# Altium schematic sheet audio_in.SchDoc
size A4
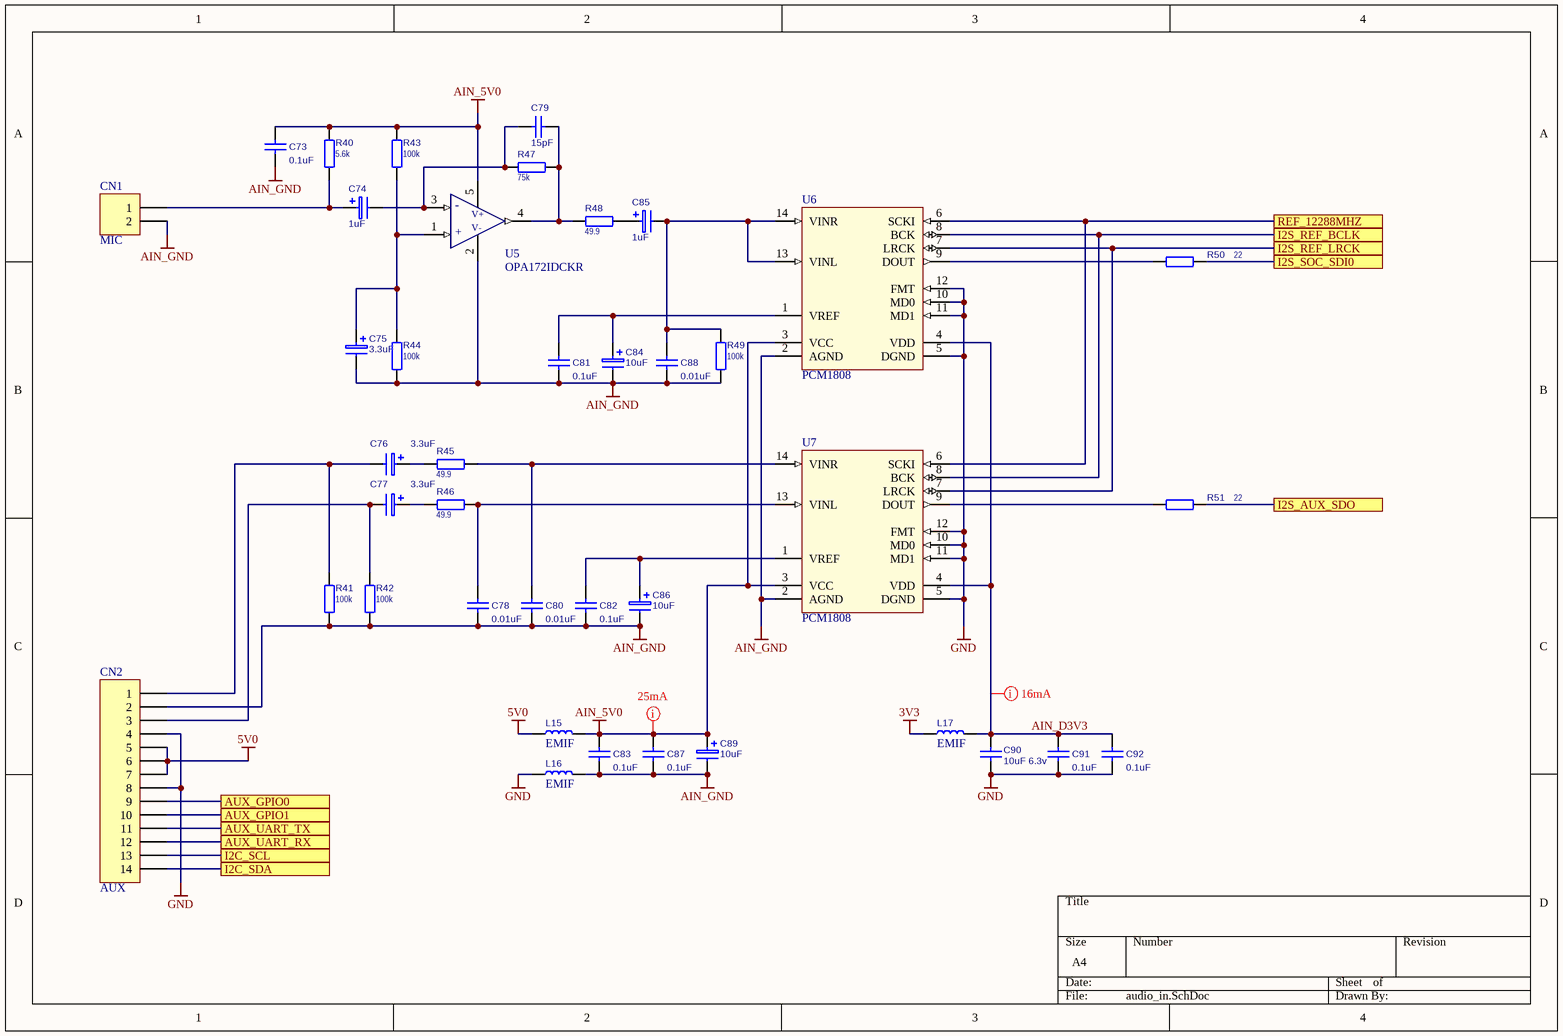
[diagram p0: audio_in.SchDoc]

## Parts
C73  value 0.1uF  [C0603]  (hidden comment: CC0603KRX7R9BB104)
C74  1uF  [ALUM_4]
C75  3.3uF  [ALUM_3.3]
C76  value 3.3uF  [ALUM_3.3]  (hidden comment: UWT1V3R3MCL2B)
C77  value 3.3uF  [ALUM_3.3]  (hidden comment: UWT1V3R3MCL2B)
C78  value 0.01uF  [C0603]  (hidden comment: CL10B103KB8NNNC)
C79  value 15pF  [C0603]  (hidden comment: CC0603GRNPO9BN150)
C80  value 0.01uF  [C0603]  (hidden comment: CL10B103KB8NNNC)
C81  value 0.1uF  [C0603]  (hidden comment: CC0603KRX7R9BB104)
C82  value 0.1uF  [C0603]  (hidden comment: CC0603KRX7R9BB104)
C83  value 0.1uF  [C0603]  (hidden comment: CC0603KRX7R9BB104)
C84  value 10uF  [ALUM_4]  (hidden comment: CB016M0010RSB-0405)
C85  1uF  [ALUM_4]
C86  value 10uF  [ALUM_4]  (hidden comment: CB016M0010RSB-0405)
C87  value 0.1uF  [C0603]  (hidden comment: CC0603KRX7R9BB104)
C88  value 0.01uF  [C0603]  (hidden comment: CL10B103KB8NNNC)
C89  value 10uF  [ALUM_3.3]  (hidden comment: CB016M0010RSB-0405)
C90  value 10uF 6.3v  [C0603]  (hidden comment: CC0603MRX5R5BB106)
C91  value 0.1uF  [C0603]  (hidden comment: CC0603KRX7R9BB104)
C92  value 0.1uF  [C0603]  (hidden comment: CC0603KRX7R9BB104)
CN1  MIC  [DG308-2.54-2P]
CN2  AUX  [PLS-14R]
L15  value EMIF  [IND0603]  (hidden comment: BLM18AG102SN1D)
L16  value EMIF  [IND0603]  (hidden comment: BLM18AG102SN1D)
L17  value EMIF  [IND0603]  (hidden comment: BLM18AG102SN1D)
R40  5.6k  [R0603]
R41  100k  [R0603]
R42  100k  [R0603]
R43  100k  [R0603]
R44  100k  [R0603]
R45  49.9  [R0603]
R46  49.9  [R0603]
R47  75k  [R0603]
R48  49.9  [R0603]
R49  100k  [R0603]
R50  22  [R0603]
R51  22  [R0603]
U5  OPA172IDCKR  [SC70-5]
U6  PCM1808  [TSSOP-14]
U7  PCM1808  [TSSOP-14]

## Ports
AUX_GPIO0, AUX_GPIO1, AUX_UART_RX, AUX_UART_TX, I2C_SCL, I2C_SDA, I2S_AUX_SDO, I2S_REF_BCLK, I2S_REF_LRCK, I2S_SOC_SDI0, REF_12288MHZ

## Nets
3V3: L17.2
5V0: CN2.5 CN2.6 CN2.7 L15.2
AIN_5V0: C73.1 C83.1 C87.1 C89.1(+) L15.1 R40.1 R43.1 U5.5(V+) U6.3(VCC) U7.3(VCC)
AIN_GND: C73.2 C75.2(-) C78.2 C80.2 C81.2 C82.2 C83.2 C84.2(-) C86.2(-) C87.2 C88.2 C89.2(-) CN1.2 CN2.2 L16.1 R41.2 R42.2 R44.2 R49.2 U5.2(V-) U6.2(AGND) U7.2(AGND)
GND: C90.1 C91.2 C92.2 CN2.4 CN2.8 L16.2 U6.5(DGND) U6.10(MD0) U6.11(MD1) U6.12(FMT) U7.5(DGND) U7.10(MD0) U7.11(MD1) U7.12(FMT)
AIN_D3V3: C90.2 C91.1 C92.1 L17.1 U6.4(VDD) U7.4(VDD)
AUX_GPIO0: CN2.9 ; port AUX_GPIO0
AUX_GPIO1: CN2.10 ; port AUX_GPIO1
AUX_UART_RX: CN2.12 ; port AUX_UART_RX
AUX_UART_TX: CN2.11 ; port AUX_UART_TX
I2C_SCL: CN2.13 ; port I2C_SCL
I2C_SDA: CN2.14 ; port I2C_SDA
I2S_AUX_SDO: R51.2 ; port I2S_AUX_SDO
I2S_REF_BCLK: U6.8(BCK) U7.8(BCK) ; port I2S_REF_BCLK
I2S_REF_LRCK: U6.7(LRCK) U7.7(LRCK) ; port I2S_REF_LRCK
I2S_SOC_SDI0: R50.2 ; port I2S_SOC_SDI0
REF_12288MHZ: U6.6(SCKI) U7.6(SCKI) ; port REF_12288MHZ
NetC74_1: C74.1(+) CN1.1 R40.2
NetC74_2: C74.2(-) C79.1 R47.2 U5.3(-)
NetC75_1: C75.1(+) R43.2 R44.1 U5.1(+)
NetC76_1: C76.1(+) R45.1
NetC76_2: C76.2(-) CN2.1 R41.1
NetC77_1: C77.1(+) R46.1
NetC77_2: C77.2(-) CN2.3 R42.1
NetC78_1: C78.1 R46.2 U7.13(VINL)
NetC79_2: C79.2 R47.1 R48.1 U5.4
NetC80_1: C80.1 R45.2 U7.14(VINR)
NetC81_1: C81.1 C84.1(+) U6.1(VREF)
NetC82_1: C82.1 C86.1(+) U7.1(VREF)
NetC85_1: C85.1(+) R48.2
NetC85_2: C85.2(-) C88.1 R49.1 U6.13(VINL) U6.14(VINR)
NetR50_1: R50.1 U6.9(DOUT)
NetR51_1: R51.1 U7.9(DOUT)

## Layout directives
mark named 16mA: AIN_D3V3
mark named 25mA: AIN_5V0

## Library data of the parts
C73 C78-C83 C87 C88 C90-C92 = CAP_NPOL
C74-C77 C84-C86 C89 = CAP_POL
  C74 C85: Value: 1uF
  C75: Value: 3.3uF
CN1 = HDR 2: Header, 2-Pin; LatestRevisionDate: 17-Jul-2002; LatestRevisionNote: Re-released for DXP Platform.; Publisher: Altium Limited
CN2 = HDR 14: Header, 14-Pin; LatestRevisionDate: 17-Jul-2002; LatestRevisionNote: Re-released for DXP Platform.; Publisher: Altium Limited
L15-L17 = IND_WO_IRON
R40-R51 = RESISTOR: RES
  R40: Value: 5.6k
  R41-R44 R49: Value: 100k
  R45 R46 R48: Value: 49.9
  R47: Value: 75k
  R50 R51: Value: 22
U5 = OPA172IDCKR: OPAx172 36-V, Single-Supply, 10-MHz, Rail-to-Rail Output Operational Amplifiers; value: OPA172IDCKR
U6 U7 = PCM1808: PCM1808 Single-Ended, Analog-Input 24-Bit, 96-kHz Stereo ADC; value: PCM1808